# EAGLE design cell_sense_tht (EAGLE 6.6.0)
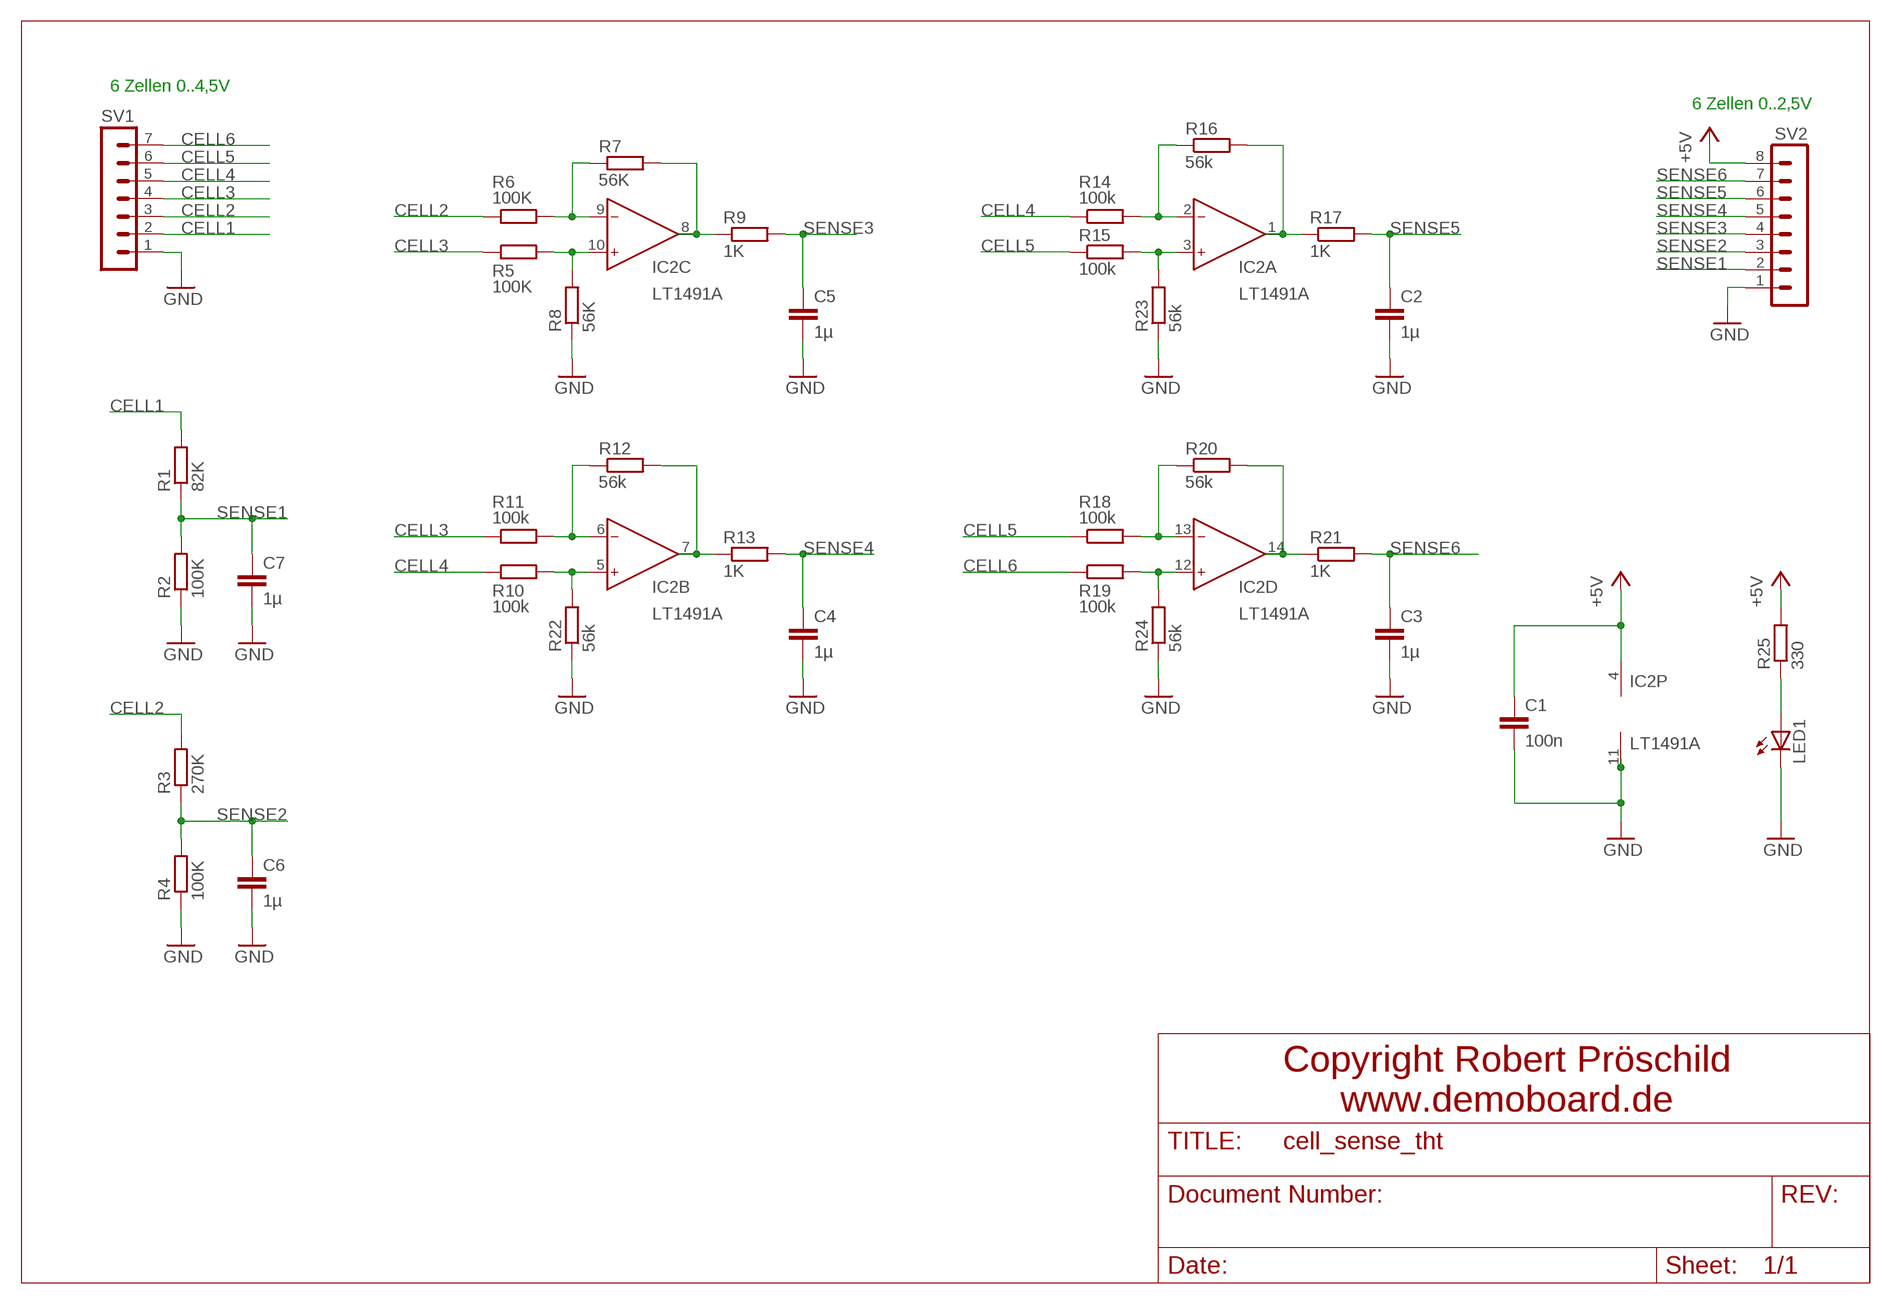
[diagram p0: schematic, sheet 1]

## Parts
C1  100n  C-EU025-024X044  [C025-024X044]
C2  1µ  C-EU025-024X044  [C025-024X044]
C3  1µ  C-EU025-024X044  [C025-024X044]
C4  1µ  C-EU025-024X044  [C025-024X044]
C5  1µ  C-EU025-024X044  [C025-024X044]
C6  1µ  C-EU025-024X044  [C025-024X044]
C7  1µ  C-EU025-024X044  [C025-024X044]
IC2  LT1491A  AD8644  [DIL14]
LED1  LED3MM  [LED3MM]
R1  82K  R-EU_0204/7  [0204/7]
R2  100K  R-EU_0204/7  [0204/7]
R3  270K  R-EU_0204/7  [0204/7]
R4  100K  R-EU_0204/7  [0204/7]
R5  100K  R-EU_0204/7  [0204/7]
R6  100K  R-EU_0204/7  [0204/7]
R7  56K  R-EU_0204/7  [0204/7]
R8  56K  R-EU_0204/7  [0204/7]
R9  1K  R-EU_0204/7  [0204/7]
R10  100k  R-EU_0204/7  [0204/7]
R11  100k  R-EU_0204/7  [0204/7]
R12  56k  R-EU_0204/7  [0204/7]
R13  1K  R-EU_0204/7  [0204/7]
R14  100k  R-EU_0204/7  [0204/7]
R15  100k  R-EU_0204/7  [0204/7]
R16  56k  R-EU_0204/7  [0204/7]
R17  1K  R-EU_0204/7  [0204/7]
R18  100k  R-EU_0204/7  [0204/7]
R19  100k  R-EU_0204/7  [0204/7]
R20  56k  R-EU_0204/7  [0204/7]
R21  1K  R-EU_0204/7  [0204/7]
R22  56k  R-EU_0204/7  [0204/7]
R23  56k  R-EU_0204/7  [0204/7]
R24  56k  R-EU_0204/7  [0204/7]
R25  330  R-EU_0204/7  [0204/7]
SV1  MA07-1  [MA07-1]
SV2  MA08-1  [MA08-1]

## Nets
+5V: C1.1 IC2.4(P:V+) R25.2 SV2.8
CELL1: R1.2 SV1.2
CELL2: R3.2 R6.1 SV1.3
CELL3: R5.1 R11.1 SV1.4
CELL4: R10.1 R14.1 SV1.5
CELL5: R15.1 R18.1 SV1.6
CELL6: R19.1 SV1.7
GND: C1.2 C2.2 C3.2 C4.2 C5.2 C6.2 C7.2 IC2.11(P:V-) LED1.K(C) R2.1 R4.1 R8.1 R22.1 R23.1 R24.1 SV1.1 SV2.1
N$1: IC2.10(C:IN+) R5.2 R8.2
N$2: IC2.9(C:IN-) R6.2 R7.1
N$3: IC2.8(C:OUT) R7.2 R9.1
N$4: LED1.A R25.1
N$6: IC2.3(A:IN+) R15.2 R23.2
N$7: IC2.2(A:IN-) R14.2 R16.1
N$8: IC2.1(A:OUT) R16.2 R17.1
N$12: IC2.5(B:IN+) R10.2 R22.2
N$13: IC2.6(B:IN-) R11.2 R12.1
N$14: IC2.7(B:OUT) R12.2 R13.1
N$18: IC2.12(D:IN+) R19.2 R24.2
N$19: IC2.13(D:IN-) R18.2 R20.1
N$20: IC2.14(D:OUT) R20.2 R21.1
SENSE1: C7.1 R1.1 R2.2 SV2.2
SENSE2: C6.1 R3.1 R4.2 SV2.3
SENSE3: C5.1 R9.2 SV2.4
SENSE4: C4.1 R13.2 SV2.5
SENSE5: C2.1 R17.2 SV2.6
SENSE6: C3.1 R21.2 SV2.7

## Notes on the sheet
- 6 Zellen 0..4,5V
- 6 Zellen 0..2,5V
- Copyright Robert Pröschild
  www.demoboard.de

## Library data of the parts
C1-C7 = rcl:C-EU: CAPACITOR, European symbol
IC2 = analog-devices:AD8644: Single and Quad 18 V Operational Amplifiers Source: http://www.analog.com/static/imported-files/data_sheets/AD8614_8644.pdf
LED1 = led:LED: LED OSRAM: - CHIPLED LG R971, LG N971, LY N971, LG Q971, LY Q971, LO R971, LY R971 LH N974, LH R974 LS Q976, LO Q976, LY Q976 LO Q996 - Hyper CHIPLED LW Q18S LB Q993, LB Q99A, LB R99A - SideLED LS A670, LO A670, LY A670, LG A670, LP A670 LB A673, LV A673, LT A673, LW A673 LH A674 LY A675 LS A676, LA A676, LO A676, LY A676, LW A676 LS A679, LY A679, LG A679 - Hyper Micro SIDELED® LS Y876, LA Y876, LO Y876, LY Y876 LT Y87S - SmartLED LW L88C, LW L88S LB L89C, LB L89S, LG L890 LS L89K, LO L89K, LY L89K LS L896, LA L896, LO L896, LY L896 - TOPLED LS T670, LO T670, LY T670, LG T670, LP T670 LSG T670, LSP T670, LSY T670, LOP T670, LYG T670 LG T671, LOG T671, LSG T671 LB T673, LV T673, LT T673, LW T673 LH T674 LS T676, LA T676, LO T676, LY T676, LB T676, LH T676, LSB T676, LW T676 LB T67C, LV T67C, LT T67C, LS T67K, LO T67K, LY T67K, LW E67C LS E67B, LA E67B, LO E67B, LY E67B, LB E67C, LV E67C, LT E67C LW T67C LS T679, LY T679, LG T679 LS T770, LO T770, LY T770, LG T770, LP T770 LB T773, LV T773, LT T773, LW T773 LH T774 LS E675, LA E675, LY E675, LS T675 LS T776, LA T776, LO T776, LY T776, LB T776 LHGB T686 LT T68C, LB T68C - Hyper Mini TOPLED® LB M676 - Mini TOPLED Santana® LG M470 LS M47K, LO M47K, LY M47K Source: http://www.osram.convergy.de LUXEON: - LUMILED® LXK2-PW12-R00, LXK2-PW12-S00, LXK2-PW14-U00, LXK2-PW14-V00 LXK2-PM12-R00, LXK2-PM12-S00, LXK2-PM14-U00 LXK2-PE12-Q00, LXK2-PE12-R00, LXK2-PE12-S00, LXK2-PE14-T00, LXK2-PE14-U00 LXK2-PB12-K00, LXK2-PB12-L00, LXK2-PB12-M00, LXK2-PB14-N00, LXK2-PB14-P00, LXK2-PB14-Q00 LXK2-PR12-L00, LXK2-PR12-M00, LXK2-PR14-Q00, LXK2-PR14-R00 LXK2-PD12-Q00, LXK2-PD12-R00, LXK2-PD12-S00 LXK2-PH12-R00, LXK2-PH12-S00 LXK2-PL12-P00, LXK2-PL12-Q00, LXK2-PL12-R00 Source: www.luxeon.com KINGBRIGHT: KA-3528ASYC Source: www.kingbright.com
R1-R25 = rcl:R-EU_: RESISTOR, European symbol
SV1 = con-lstb:MA07-1: PIN HEADER; OC_FARNELL: unknown; OC_NEWARK: unknown
SV2 = con-lstb:MA08-1: PIN HEADER; OC_FARNELL: unknown; OC_NEWARK: unknown

## Board
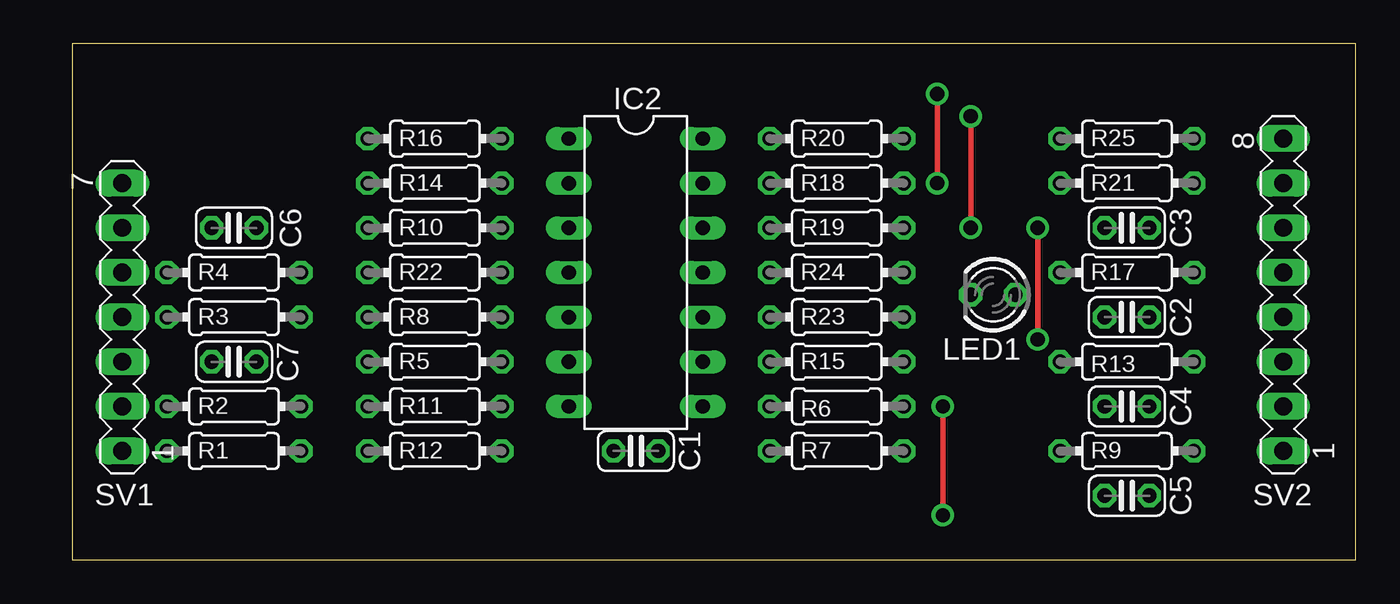
[diagram p1: board, top side]
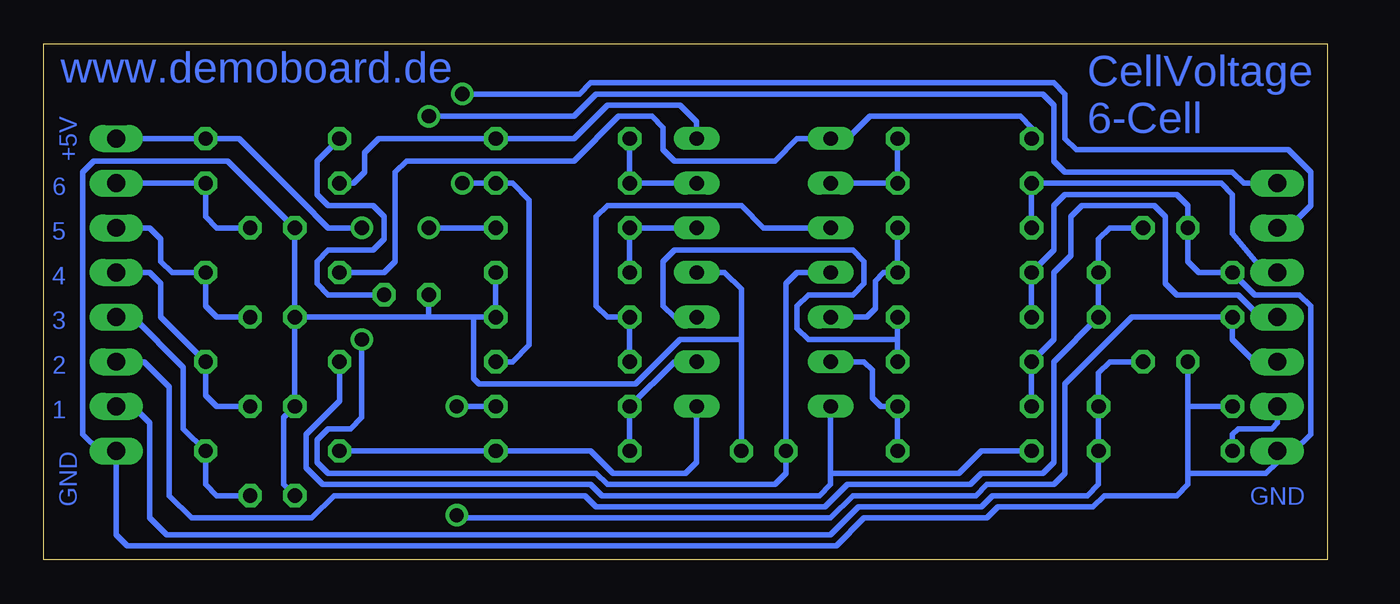
[diagram p2: board, bottom side, seen from below]

Size 73.01 x 29.36 mm. Coordinates in mm from the lower left corner, seen from the top.
Outline: 0,0 73.01,0 73.01,29.36 0,29.36 0,0
Copper layers (1*16): Top 0.035mm / dielectric 1.5mm / Bottom 0.035mm
Design rules "M&V *": minimum track width 0.18mm, minimum drill 0.5mm, track to track 0.2mm, track to pad 0.2mm, pad to pad 0.2mm, via to via 0.2mm, smd to smd 6mil, copper to edge 0.5mm, drill to drill 0.2mm, minimum pad ring 10mil, minimum via ring 6mil, stop-mask expansion 4mil, vias tented up to drill 0mil, thermal gap 10mil

### Footprints (pad centres in the part's own frame; a part is rotated, then mirrored left to right if it is on the bottom)
C025-024X044 = drill 0.813 octagon: 1 -1.27,0; 2 1.27,0
DIL14 = drill 0.813 long: 1 -7.62,-3.81; 2 -5.08,-3.81; 3 -2.54,-3.81; 4 0,-3.81; 5 2.54,-3.81; 6 5.08,-3.81; 7 7.62,-3.81; 8 7.62,3.81; 9 5.08,3.81; 10 2.54,3.81; 11 0,3.81; 12 -2.54,3.81; 13 -5.08,3.81; 14 -7.62,3.81
LED3MM = drill 0.813 octagon: A -1.27,0; K 1.27,0
0204/7 = drill 0.813 octagon: 1 -3.81,0; 2 3.81,0
MA07-1 = drill 1.016 long: 1 -7.62,0; 2 -5.08,0; 3 -2.54,0; 4 0,0; 5 2.54,0; 6 5.08,0; 7 7.62,0
MA08-1 = drill 1.016 long: 1 -8.89,0; 2 -6.35,0; 3 -3.81,0; 4 -1.27,0; 5 1.27,0; 6 3.81,0; 7 6.35,0; 8 8.89,0

### Placement (x,y rotation side)
C1  32.07,6.19 0 top
C2  60.01,13.81 180 top
C3  60.01,18.89 180 top
C4  60.01,8.73 180 top
C5  60.01,3.65 180 top
C6  9.21,18.89 180 top
C7  9.21,11.27 180 top
IC2  32.07,16.35 270 top
LED1  52.39,15.08 180 top
R1  9.21,6.19 180 top
R2  9.21,8.73 0 top
R3  9.21,13.81 180 top
R4  9.21,16.35 0 top
R5  20.64,11.27 0 top
R6  43.5,8.73 180 top
R7  43.5,6.19 0 top
R8  20.64,13.81 0 top
R9  60.01,6.19 0 top
R10  20.64,18.89 0 top
R11  20.64,8.73 0 top
R12  20.64,6.19 180 top
R13  60.01,11.27 0 top
R14  20.64,21.43 0 top
R15  43.5,11.27 180 top
R16  20.64,23.97 180 top
R17  60.01,16.35 0 top
R18  43.5,21.43 180 top
R19  43.5,18.89 180 top
R20  43.5,23.97 0 top
R21  60.01,21.43 0 top
R22  20.64,16.35 0 top
R23  43.5,13.81 180 top
R24  43.5,16.35 180 top
R25  60.01,23.97 0 top
SV1  2.86,13.81 90 top
SV2  68.9,15.08 90 top

### Tracks (layer width: path | path; a pad name or v marks a point on that pad's centre or on a via)
+5V  (via drill 0.8 pad 1.27)
  Top 0.3: v54.93,18.89 v54.93,12.54
  Bottom 0.3: IC2.4 30.16,16.35 30.8,15.72 C1.1 30.8,4.92 31.43,4.29 40.96,4.29 41.59,4.92 56.83,4.92 57.47,5.56 57.47,6.83 56.83,7.46 55.56,7.46 54.93,8.1 v54.93,12.54 | SV2.8 R25.2 61.91,23.97 58.42,20.48 56.83,18.89 v54.93,18.89
CELL1
  Bottom 0.3: SV1.2 2.86,7.78 3.17,7.46 5.08,7.46 5.4,7.14 R1.2
CELL2  (via drill 0.8 pad 1.27)
  Top 0.3: v49.53,2.54 v49.53,8.73
  Bottom 0.3: SV1.3 4.13,11.27 5.4,12.54 R3.2 11.11,13.81 14.92,10 14.92,4.92 15.56,4.29 19.37,4.29 20,3.65 26.99,3.65 28.26,2.38 49.21,2.38 49.37,2.54 v49.53,2.54 | v49.53,8.73 R6.1
CELL3
  Bottom 0.3: R11.1 R5.1 15.56,12.54 15.56,16.35 14.61,17.3 14.61,19.53 13.97,20.16 9.84,20.16 9.21,19.53 9.21,15.72 8.57,15.08 5.08,15.08 3.81,13.81 SV1.4
CELL4
  Bottom 0.3: R10.1 R14.1 6.03,21.43 5.4,20.8 5.4,18.57 3.81,16.67 SV1.5
CELL5  (via drill 0.8 pad 1.27)
  Top 0.3: v49.21,21.43 v49.21,26.51
  Bottom 0.3: R15.1 46.35,11.27 45.4,12.22 45.4,20.48 46.35,21.43 R18.1 v49.21,21.43 | SV1.6 2.22,18.89 0.95,20.16 0.95,22.07 2.22,23.34 14.29,23.34 14.92,23.97 14.92,26.51 15.56,27.15 41.91,27.15 42.55,26.51 v49.21,26.51
CELL6  (via drill 0.8 pad 1.27)
  Top 0.3: v51.12,25.24 v51.12,18.89
  Bottom 0.3: SV1.7 4.76,21.43 5.4,22.07 14.92,22.07 15.56,22.7 15.56,25.88 16.19,26.51 41.59,26.51 42.86,25.24 v51.12,25.24 | v51.12,18.89 R19.1
GND
  Bottom 0.3: C1.2 33.34,12.54 | 33.34,12.54 33.34,15.4 34.29,16.35 IC2.11 | C2.2 C4.2 59.37,8.1 59.37,4.29 C5.2 | C2.2 C3.2 62.55,22.7 70.17,22.7 70.8,22.07 70.8,7.14 69.85,6.19 SV2.1 68.9,1.43 68.26,0.79 27.94,0.79 26.35,2.38 19.37,2.38 18.73,3.02 13.34,3.02 12.7,3.65 8.57,3.65 7.94,4.29 7.94,4.92 | R8.1 R22.1 15.56,17.62 15.56,20.16 14.92,20.8 8.57,20.8 7.94,20.16 C6.2 7.94,16.99 7.3,16.35 R4.1 4.13,15.08 1.59,15.08 0.95,14.45 0.95,7.14 1.91,6.19 SV1.1 2.86,5.56 3.49,4.92 7.94,4.92 | R24.1 R23.1 48.58,13.81 | 7.94,4.92 7.94,8.73 | 7.94,8.73 C7.2 | R2.1 7.94,8.73 | 48.58,13.81 48.58,10.32 48.26,10 39.37,10 36.83,12.54 33.34,12.54 | C2.2 51.12,13.81 | 51.12,13.81 48.58,13.81 | LED1.K 51.12,13.81
N$1
  Bottom 0.3: R8.2 24.45,12.54 | 24.45,12.54 R5.2 | IC2.10 37.15,13.81 37.78,14.45 37.78,16.99 37.15,17.62 26.99,17.62 26.35,16.99 26.35,15.72 26.99,15.08 29.53,15.08 30.16,14.45 30.16,13.18 29.53,12.54 24.45,12.54
N$2
  Bottom 0.3: R7.1 R6.2 37.15,11.27 IC2.9
N$3
  Bottom 0.3: IC2.8 35.88,5.56 36.51,4.92 40.64,4.92 41.91,6.19 R7.2 R9.1
N$4
  Bottom 0.3: LED1.A 56.83,15.08 57.47,15.72 57.47,16.99 56.83,17.62 54.29,17.62 53.66,18.26 53.66,19.53 54.29,20.16 56.83,20.16 57.47,20.8 57.47,22.7 R25.1
N$6
  Bottom 0.3: R15.2 R23.2 40.96,13.81 41.59,14.45 41.59,19.53 40.96,20.16 33.34,20.16 32.07,18.89 IC2.3
N$7
  Bottom 0.3: R16.1 R14.2 IC2.2
N$8
  Bottom 0.3: R16.2 16.83,24.61 17.46,25.24 26.04,25.24 27.3,23.97 IC2.1 30.16,23.97 31.43,22.7 37.15,22.7 37.78,23.34 37.78,24.61 38.42,25.24 40.32,25.24 42.86,22.7 52.39,22.7 53.02,22.07 53.02,16.99 53.66,16.35 R17.1
N$12
  Bottom 0.3: R10.2 R22.2 25.24,16.35 25.72,15.87 25.72,14.29 26.19,13.81 IC2.5
N$13
  Bottom 0.3: R12.1 R11.2 25.4,8.73 25.88,9.21 25.88,10.79 26.35,11.27 IC2.6
N$14
  Bottom 0.3: R12.2 19.68,6.19 20.95,4.92 28.26,4.92 | IC2.7 28.26,4.92 | 28.26,4.92 28.26,4.29 28.89,3.65 41.27,3.65 41.91,4.29 57.15,4.29 58.1,5.24 58.1,7.14 56.2,9.05 R13.1
N$18
  Bottom 0.3: R24.2 R19.2 IC2.12
N$19
  Bottom 0.3: IC2.13 R18.2 R20.1
N$20
  Bottom 0.3: IC2.14 35.88,24.92 36.83,25.88 40.96,25.88 42.86,23.97 R20.2 53.98,23.97 54.77,23.18 54.77,22.07 55.4,21.43 R21.1
SENSE1
  Bottom 0.3: C7.1 12.38,11.27 13.02,10.64 R2.2 R1.1 13.02,4.29 13.65,3.65 19.05,3.65 19.68,3.02 26.67,3.02 28.26,1.43 66.04,1.43 66.99,2.38 66.99,7.78 67.94,8.73 SV2.2
SENSE2
  Bottom 0.3: C6.1 12.38,18.89 13.02,18.26 R4.2 R3.1 15.56,11.27 15.56,5.56 16.19,4.92 19.68,4.92 20.32,4.29 27.3,4.29 28.57,3.02 41.59,3.02 42.23,3.65 56.52,3.65 57.78,2.38 64.61,2.38 65.88,3.65 65.88,9.84 67.31,11.27 SV2.3
SENSE3
  Bottom 0.3: SV2.4 67.94,13.81 65.09,10.95 65.09,7.46 R9.2 63.82,4.29 63.18,3.65 C5.1
SENSE4
  Bottom 0.3: SV2.5 66.99,16.35 66.36,15.72 66.36,13.81 R13.2 63.82,9.37 63.18,8.73 C4.1
SENSE5
  Bottom 0.3: SV2.6 66.99,18.89 66.36,18.26 66.36,16.99 65.72,16.35 R17.2 63.82,14.45 63.18,13.81 C2.1
SENSE6
  Bottom 0.3: SV2.7 R21.2 63.82,19.53 63.18,18.89 C3.1

### Text on the board
Bottom: www.demoboard.de | CellVoltage / 6-Cell | +5V | 6 | 5 | 4 | 3 | 2 | 1 | GND | GND